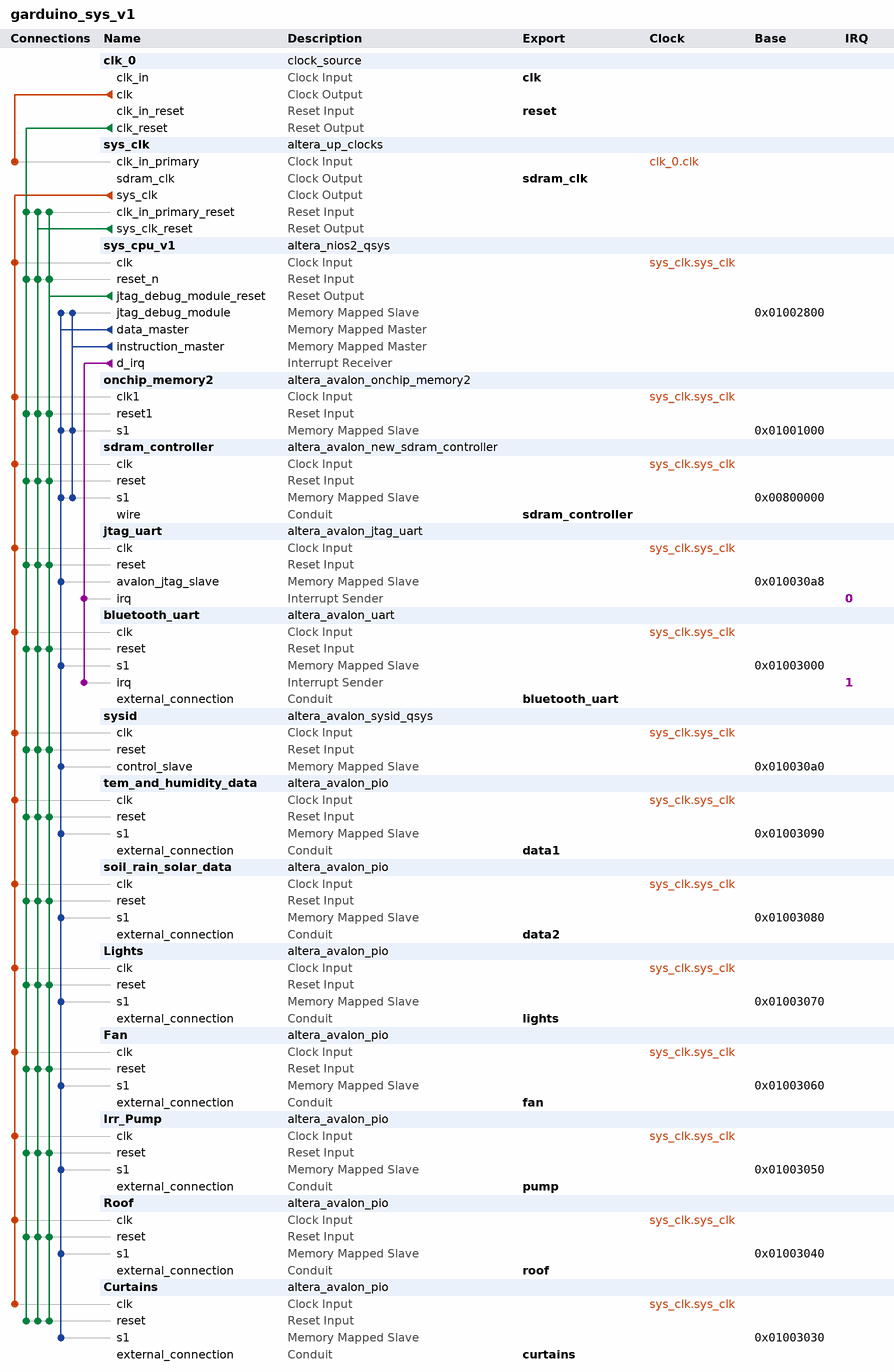
[diagram p0: system contents]
# Platform Designer (Qsys) system garduino_sys_v1, Cyclone II EP2C35F672C6
# Parameters at their usual value, and those the tool derives, are not listed.
package require -exact qsys 13.0.1.99.2
create_system garduino_sys_v1
set_project_property DEVICE_FAMILY {Cyclone II}
set_project_property DEVICE EP2C35F672C6

add_instance clk_0 clock_source 13.0
set_instance_parameter_value clk_0 clockFrequency 50000000

add_instance sys_clk altera_up_clocks 13.0
set_instance_parameter_value sys_clk board DE2
set_instance_parameter_value sys_clk vga_clk false
set_instance_parameter_value sys_clk audio_clk false
set_instance_parameter_value sys_clk audio_clk_freq 12.288

add_instance sys_cpu_v1 altera_nios2_qsys 13.0
set_instance_parameter_value sys_cpu_v1 resetSlave sdram_controller.s1
set_instance_parameter_value sys_cpu_v1 mmu_TLBMissExcSlave None
set_instance_parameter_value sys_cpu_v1 exceptionSlave sdram_controller.s1
set_instance_parameter_value sys_cpu_v1 breakSlave sys_cpu_v1.jtag_debug_module
set_instance_parameter_value sys_cpu_v1 impl Tiny
set_instance_parameter_value sys_cpu_v1 icache_size 4096

add_instance onchip_memory2 altera_avalon_onchip_memory2 13.0.1.99.2
set_instance_parameter_value onchip_memory2 dataWidth 32
set_instance_parameter_value onchip_memory2 dualPort false
set_instance_parameter_value onchip_memory2 initMemContent true
set_instance_parameter_value onchip_memory2 initializationFileName onchip_mem.hex
set_instance_parameter_value onchip_memory2 memorySize 4096

add_instance sdram_controller altera_avalon_new_sdram_controller 13.0.1.99.2
set_instance_parameter_value sdram_controller TAC 5.5
set_instance_parameter_value sdram_controller TRCD 20.0
set_instance_parameter_value sdram_controller TRP 20.0
set_instance_parameter_value sdram_controller casLatency 3
set_instance_parameter_value sdram_controller columnWidth 8
set_instance_parameter_value sdram_controller dataWidth 16
set_instance_parameter_value sdram_controller generateSimulationModel false
set_instance_parameter_value sdram_controller model single_Micron_MT48LC4M32B2_7_chip
set_instance_parameter_value sdram_controller numberOfBanks 4
set_instance_parameter_value sdram_controller numberOfChipSelects 1
set_instance_parameter_value sdram_controller powerUpDelay 100.0
set_instance_parameter_value sdram_controller refreshPeriod 15.625
set_instance_parameter_value sdram_controller rowWidth 12

add_instance jtag_uart altera_avalon_jtag_uart 13.0.1.99.2
set_instance_parameter_value jtag_uart simInteractiveOptions NO_INTERACTIVE_WINDOWS

add_instance bluetooth_uart altera_avalon_uart 13.0.1.99.2
set_instance_parameter_value bluetooth_uart baud 9600
set_instance_parameter_value bluetooth_uart dataBits 8
set_instance_parameter_value bluetooth_uart fixedBaud true
set_instance_parameter_value bluetooth_uart parity NONE
set_instance_parameter_value bluetooth_uart stopBits 1

add_instance sysid altera_avalon_sysid_qsys 13.0
set_instance_parameter_value sysid id 0

add_instance tem_and_humidity_data altera_avalon_pio 13.0.1.99.2
set_instance_parameter_value tem_and_humidity_data direction Input
set_instance_parameter_value tem_and_humidity_data width 32

add_instance soil_rain_solar_data altera_avalon_pio 13.0.1.99.2
set_instance_parameter_value soil_rain_solar_data direction Input
set_instance_parameter_value soil_rain_solar_data width 24

add_instance Lights altera_avalon_pio 13.0.1.99.2
set_instance_parameter_value Lights direction Output
set_instance_parameter_value Lights width 9

add_instance Fan altera_avalon_pio 13.0.1.99.2
set_instance_parameter_value Fan direction Output
set_instance_parameter_value Fan width 9

add_instance Irr_Pump altera_avalon_pio 13.0.1.99.2
set_instance_parameter_value Irr_Pump direction Output
set_instance_parameter_value Irr_Pump width 9

add_instance Roof altera_avalon_pio 13.0.1.99.2
set_instance_parameter_value Roof direction Output
set_instance_parameter_value Roof width 10

add_instance Curtains altera_avalon_pio 13.0.1.99.2
set_instance_parameter_value Curtains direction Output
set_instance_parameter_value Curtains width 3

# connections
add_connection clk_0.clk sys_clk.clk_in_primary clock
add_connection sys_clk.sys_clk bluetooth_uart.clk clock
add_connection sys_clk.sys_clk Curtains.clk clock
add_connection sys_clk.sys_clk Fan.clk clock
add_connection sys_clk.sys_clk Irr_Pump.clk clock
add_connection sys_clk.sys_clk jtag_uart.clk clock
add_connection sys_clk.sys_clk Lights.clk clock
add_connection sys_clk.sys_clk onchip_memory2.clk1 clock
add_connection sys_clk.sys_clk Roof.clk clock
add_connection sys_clk.sys_clk sdram_controller.clk clock
add_connection sys_clk.sys_clk soil_rain_solar_data.clk clock
add_connection sys_clk.sys_clk sys_cpu_v1.clk clock
add_connection sys_clk.sys_clk sysid.clk clock
add_connection sys_clk.sys_clk tem_and_humidity_data.clk clock
add_connection clk_0.clk_reset bluetooth_uart.reset reset
add_connection clk_0.clk_reset Curtains.reset reset
add_connection clk_0.clk_reset Fan.reset reset
add_connection clk_0.clk_reset Irr_Pump.reset reset
add_connection clk_0.clk_reset jtag_uart.reset reset
add_connection clk_0.clk_reset Lights.reset reset
add_connection clk_0.clk_reset onchip_memory2.reset1 reset
add_connection clk_0.clk_reset Roof.reset reset
add_connection clk_0.clk_reset sdram_controller.reset reset
add_connection clk_0.clk_reset soil_rain_solar_data.reset reset
add_connection clk_0.clk_reset sys_clk.clk_in_primary_reset reset
add_connection clk_0.clk_reset sys_cpu_v1.reset_n reset
add_connection clk_0.clk_reset sysid.reset reset
add_connection clk_0.clk_reset tem_and_humidity_data.reset reset
add_connection sys_clk.sys_clk_reset bluetooth_uart.reset reset
add_connection sys_clk.sys_clk_reset Curtains.reset reset
add_connection sys_clk.sys_clk_reset Fan.reset reset
add_connection sys_clk.sys_clk_reset Irr_Pump.reset reset
add_connection sys_clk.sys_clk_reset jtag_uart.reset reset
add_connection sys_clk.sys_clk_reset Lights.reset reset
add_connection sys_clk.sys_clk_reset onchip_memory2.reset1 reset
add_connection sys_clk.sys_clk_reset Roof.reset reset
add_connection sys_clk.sys_clk_reset sdram_controller.reset reset
add_connection sys_clk.sys_clk_reset soil_rain_solar_data.reset reset
add_connection sys_clk.sys_clk_reset sys_clk.clk_in_primary_reset reset
add_connection sys_clk.sys_clk_reset sys_cpu_v1.reset_n reset
add_connection sys_clk.sys_clk_reset sysid.reset reset
add_connection sys_clk.sys_clk_reset tem_and_humidity_data.reset reset
add_connection sys_cpu_v1.jtag_debug_module_reset bluetooth_uart.reset reset
add_connection sys_cpu_v1.jtag_debug_module_reset Curtains.reset reset
add_connection sys_cpu_v1.jtag_debug_module_reset Fan.reset reset
add_connection sys_cpu_v1.jtag_debug_module_reset Irr_Pump.reset reset
add_connection sys_cpu_v1.jtag_debug_module_reset jtag_uart.reset reset
add_connection sys_cpu_v1.jtag_debug_module_reset Lights.reset reset
add_connection sys_cpu_v1.jtag_debug_module_reset onchip_memory2.reset1 reset
add_connection sys_cpu_v1.jtag_debug_module_reset Roof.reset reset
add_connection sys_cpu_v1.jtag_debug_module_reset sdram_controller.reset reset
add_connection sys_cpu_v1.jtag_debug_module_reset soil_rain_solar_data.reset reset
add_connection sys_cpu_v1.jtag_debug_module_reset sys_clk.clk_in_primary_reset reset
add_connection sys_cpu_v1.jtag_debug_module_reset sys_cpu_v1.reset_n reset
add_connection sys_cpu_v1.jtag_debug_module_reset sysid.reset reset
add_connection sys_cpu_v1.jtag_debug_module_reset tem_and_humidity_data.reset reset
add_connection sys_cpu_v1.data_master bluetooth_uart.s1 avalon
set_connection_parameter_value sys_cpu_v1.data_master/bluetooth_uart.s1 baseAddress 0x01003000
add_connection sys_cpu_v1.data_master Curtains.s1 avalon
set_connection_parameter_value sys_cpu_v1.data_master/Curtains.s1 baseAddress 0x01003030
add_connection sys_cpu_v1.data_master Fan.s1 avalon
set_connection_parameter_value sys_cpu_v1.data_master/Fan.s1 baseAddress 0x01003060
add_connection sys_cpu_v1.data_master Irr_Pump.s1 avalon
set_connection_parameter_value sys_cpu_v1.data_master/Irr_Pump.s1 baseAddress 0x01003050
add_connection sys_cpu_v1.data_master jtag_uart.avalon_jtag_slave avalon
set_connection_parameter_value sys_cpu_v1.data_master/jtag_uart.avalon_jtag_slave baseAddress 0x010030a8
add_connection sys_cpu_v1.data_master Lights.s1 avalon
set_connection_parameter_value sys_cpu_v1.data_master/Lights.s1 baseAddress 0x01003070
add_connection sys_cpu_v1.data_master onchip_memory2.s1 avalon
set_connection_parameter_value sys_cpu_v1.data_master/onchip_memory2.s1 baseAddress 0x01001000
add_connection sys_cpu_v1.data_master Roof.s1 avalon
set_connection_parameter_value sys_cpu_v1.data_master/Roof.s1 baseAddress 0x01003040
add_connection sys_cpu_v1.data_master sdram_controller.s1 avalon
set_connection_parameter_value sys_cpu_v1.data_master/sdram_controller.s1 baseAddress 0x00800000
add_connection sys_cpu_v1.data_master soil_rain_solar_data.s1 avalon
set_connection_parameter_value sys_cpu_v1.data_master/soil_rain_solar_data.s1 baseAddress 0x01003080
add_connection sys_cpu_v1.data_master sys_cpu_v1.jtag_debug_module avalon
set_connection_parameter_value sys_cpu_v1.data_master/sys_cpu_v1.jtag_debug_module baseAddress 0x01002800
add_connection sys_cpu_v1.data_master sysid.control_slave avalon
set_connection_parameter_value sys_cpu_v1.data_master/sysid.control_slave baseAddress 0x010030a0
add_connection sys_cpu_v1.data_master tem_and_humidity_data.s1 avalon
set_connection_parameter_value sys_cpu_v1.data_master/tem_and_humidity_data.s1 baseAddress 0x01003090
add_connection sys_cpu_v1.instruction_master onchip_memory2.s1 avalon
set_connection_parameter_value sys_cpu_v1.instruction_master/onchip_memory2.s1 baseAddress 0x01001000
add_connection sys_cpu_v1.instruction_master sdram_controller.s1 avalon
set_connection_parameter_value sys_cpu_v1.instruction_master/sdram_controller.s1 baseAddress 0x00800000
add_connection sys_cpu_v1.instruction_master sys_cpu_v1.jtag_debug_module avalon
set_connection_parameter_value sys_cpu_v1.instruction_master/sys_cpu_v1.jtag_debug_module baseAddress 0x01002800
add_connection sys_cpu_v1.d_irq bluetooth_uart.irq interrupt
set_connection_parameter_value sys_cpu_v1.d_irq/bluetooth_uart.irq irqNumber 1
add_connection sys_cpu_v1.d_irq jtag_uart.irq interrupt
set_connection_parameter_value sys_cpu_v1.d_irq/jtag_uart.irq irqNumber 0

# exported interfaces
add_interface clk clock sink
set_interface_property clk EXPORT_OF clk_0.clk_in
add_interface reset reset sink
set_interface_property reset EXPORT_OF clk_0.clk_in_reset
add_interface sdram_controller conduit end
set_interface_property sdram_controller EXPORT_OF sdram_controller.wire
add_interface bluetooth_uart conduit end
set_interface_property bluetooth_uart EXPORT_OF bluetooth_uart.external_connection
add_interface sdram_clk clock source
set_interface_property sdram_clk EXPORT_OF sys_clk.sdram_clk
add_interface data1 conduit end
set_interface_property data1 EXPORT_OF tem_and_humidity_data.external_connection
add_interface data2 conduit end
set_interface_property data2 EXPORT_OF soil_rain_solar_data.external_connection
add_interface lights conduit end
set_interface_property lights EXPORT_OF Lights.external_connection
add_interface fan conduit end
set_interface_property fan EXPORT_OF Fan.external_connection
add_interface roof conduit end
set_interface_property roof EXPORT_OF Roof.external_connection
add_interface curtains conduit end
set_interface_property curtains EXPORT_OF Curtains.external_connection
add_interface pump conduit end
set_interface_property pump EXPORT_OF Irr_Pump.external_connection

set_interconnect_requirement {$system} qsys_mm.clockCrossingAdapter HANDSHAKE
set_interconnect_requirement {$system} qsys_mm.maxAdditionalLatency 1

save_system garduino_sys_v1.qsys
